# EAGLE design source_eagle (EAGLE 9.6.2)
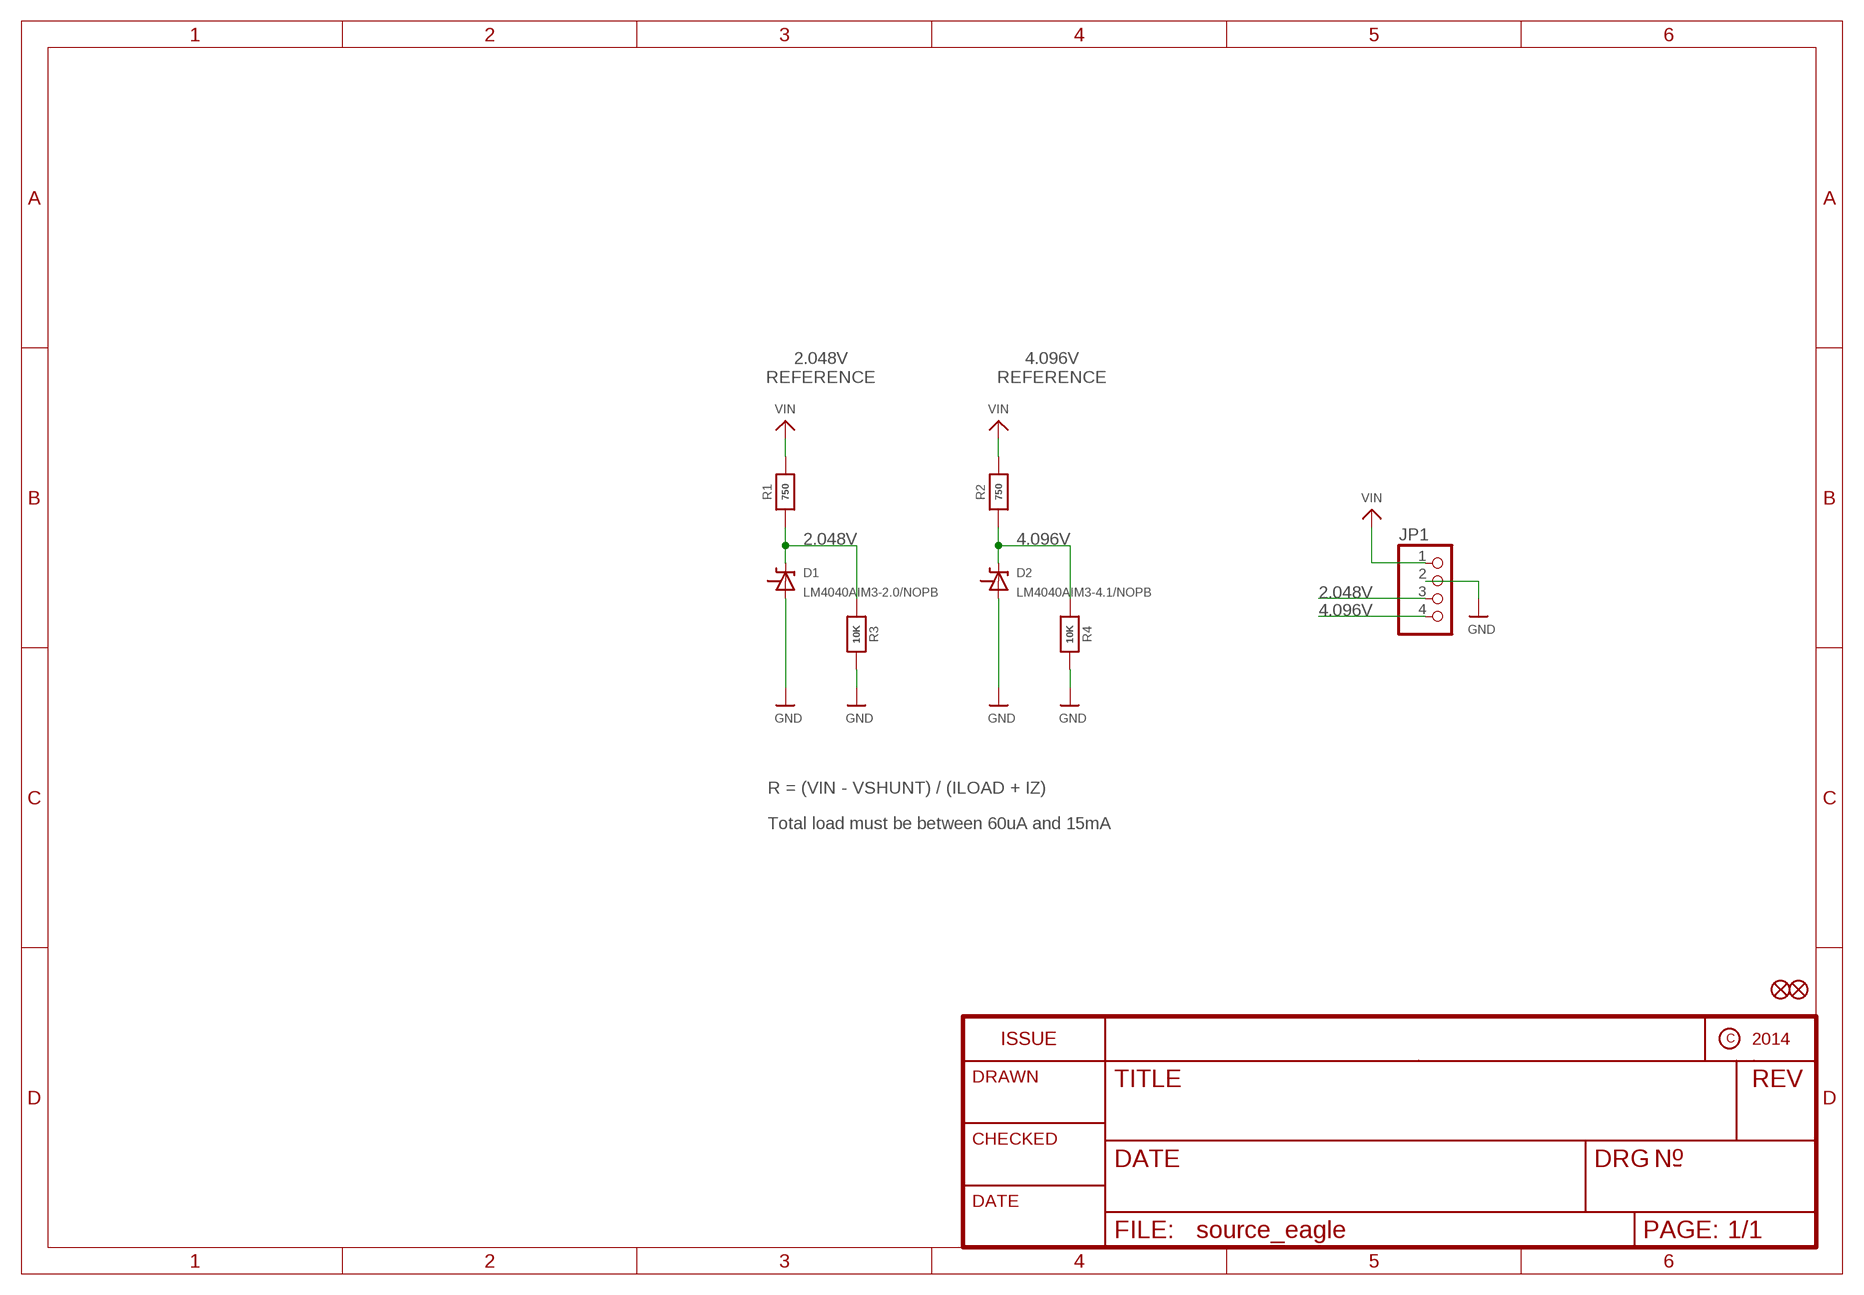
[diagram p0: schematic, sheet 1]

## Parts
D1  LM4040AIM3-2.0/NOPB  VREF_SHUNT  [SOT23-R]
D2  LM4040AIM3-4.1/NOPB  VREF_SHUNT  [SOT23-R]
FID1  FIDUCIAL""  [FIDUCIAL_1MM]
FID2  FIDUCIAL""  [FIDUCIAL_1MM]
JP1  HEADER-1X4ROUND  [1X04_ROUND]
R1  750  RESISTOR0805_NOOUTLINE  [0805-NO]
R2  750  RESISTOR0805_NOOUTLINE  [0805-NO]
R3  10K  RESISTOR0805_NOOUTLINE  [0805-NO]
R4  10K  RESISTOR0805_NOOUTLINE  [0805-NO]

## Nets
2.048V: D1.1(+) JP1.3 R1.1 R3.1
4.096V: D2.1(+) JP1.4 R2.1 R4.1
GND: D1.2(-) D2.2(-) JP1.2 R3.2 R4.2
VIN: JP1.1 R1.2 R2.2
Unconnected: D1.3(NC) D2.3(NC)

## Notes on the sheet
- 2.048V
  REFERENCE
- 4.096V
  REFERENCE
- R = (VIN - VSHUNT) / (ILOAD + IZ)
- Total load must be between 60uA and 15mA

## Library data of the parts
D1 D2 = microbuilder:VREF_SHUNT: Shunt Voltage Reference SOT23 Package LM4040-N - 2.048V or 4.096V Output, -0.3 - 6V Input, 0.1% accuracy (A grade), SOT23 (2.048V = Digikey: LM4040AIM3-2.0/NOPBTR-ND 4.096V = Digikey: LM4040AIM3-4.1/NOPBTR-ND
FID1 FID2 = microbuilder:FIDUCIAL: Fiducial Alignment Points Various fiducial points for machine vision alignment.; BOM: EXCLUDE
JP1 = microbuilder:HEADER-1X4: PIN HEADER
R1-R4 = microbuilder:RESISTOR: Resistors For new designs, use the packages preceded by an '_' character since they are more reliable: The following footprints should be used on most boards: _0402 - Standard footprint for regular board layouts _0603 - Standard footprint for regular board layouts _0805 - Standard footprint for regular board layouts _1206 - Standard footprint for regular board layouts For extremely tight-pitch boards where space is at a premium, the following 'micro-pitch' footprints can be used (smaller pads, no silkscreen outline, etc.): _0402MP - Micro-pitch footprint for very dense/compact boards _0603MP - Micro-pitch footprint for very dense/compact boards _0805MP - Micro-pitch footprint for very dense/compact boards _1206MP - Micro-pitch footprint for very dense/compact boards

## Board
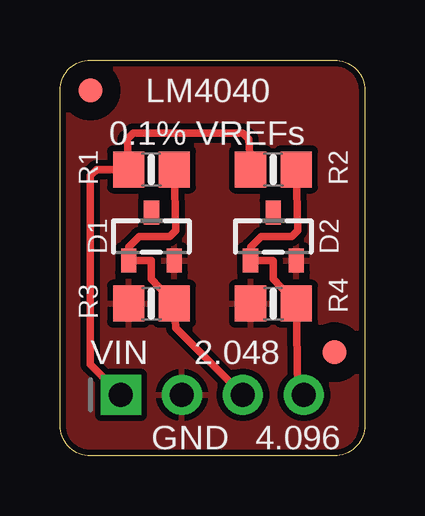
[diagram p1: board, top side]
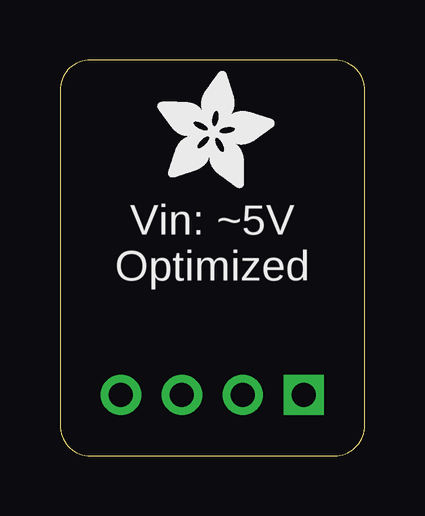
[diagram p2: board, bottom side, seen from below]

Size 12.7 x 16.51 mm. Coordinates in mm from the lower left corner, seen from the top.
Outline: 0,1.27 0,15.24 arc-90 1.27,16.51 11.43,16.51 arc-90 12.7,15.24 12.7,1.27 arc-90 11.43,0 1.27,0 arc-90 0,1.27
Copper layers (1*16): Top 0.035mm / dielectric 1.5mm / Bottom 0.035mm
Design rules "adafruit": minimum track width 8mil, minimum drill 15.5mil, track to track 8mil, track to pad 8mil, pad to pad 8mil, via to via 8mil, smd to smd 8mil, copper to edge 10mil, drill to drill 8mil, minimum pad ring 10mil, minimum via ring 8mil, stop-mask expansion 2mil, vias tented up to drill 20mil, thermal gap 10mil

### Footprints (pad centres in the part's own frame; a part is rotated, then mirrored left to right if it is on the bottom)
SOT23-R = smd 0.635 x 1.016: 1 -0.95,-1; 2 0.95,-1; 3 0,1
FIDUCIAL_1MM = smd 1 x 1: 1 0,0
1X04_ROUND = drill 1 pad 1.676 square: 1 -3.81,0 | drill 1 pad 1.676: 2 -1.27,0; 3 1.27,0; 4 3.81,0
0805-NO = smd 1.3 x 1.5: 1 -0.95,0; 2 0.95,0

### Placement (x,y rotation side)
D1  3.81,9.14 0 top
D2  8.89,9.14 0 top
FID1  1.27,15.24 0 top
FID2  11.43,4.32 0 top
JP1  6.35,2.54 0 top
R1  3.81,11.94 180 top
R2  8.89,11.94 180 top
R3  3.81,6.35 180 top
R4  8.89,6.35 180 top
U$5  [ADAFRUIT_5MM]  8.64,11.18 0 bottom

### Tracks (layer width: path | path; a pad name or v marks a point on that pad's centre or on a via)
2.048V
  Top 0.305: R1.1 4.83,9.4 4.57,9.14 3.3,9.14 2.86,8.7 D1.1 3.79,8.14 3.81,8.13 3.81,7.37 R3.1 4.83,5.33 JP1.3
4.096V
  Top 0.305: R2.1 9.91,9.4 9.65,9.14 8.38,9.14 7.94,8.7 D2.1 8.87,8.14 8.89,8.13 8.89,7.37 R4.1 9.91,2.79 JP1.4
GND
  pour Top (isolate 0.254): 0,0 0,16.26 12.7,16.26 12.7,0
VIN
  Top 0.305: JP1.1 1.27,3.81 1.27,11.68 1.52,11.94 R1.2 2.79,13.21 3.05,13.46 7.62,13.46 7.87,13.21 R2.2

### Text on the board
tPlace: LM4040 | 0.1% VREFs | VIN | 2.048 | GND | 4.096
bPlace: Vin: ~5V / Optimized